# Altium project Relay_Module.PrjPcb
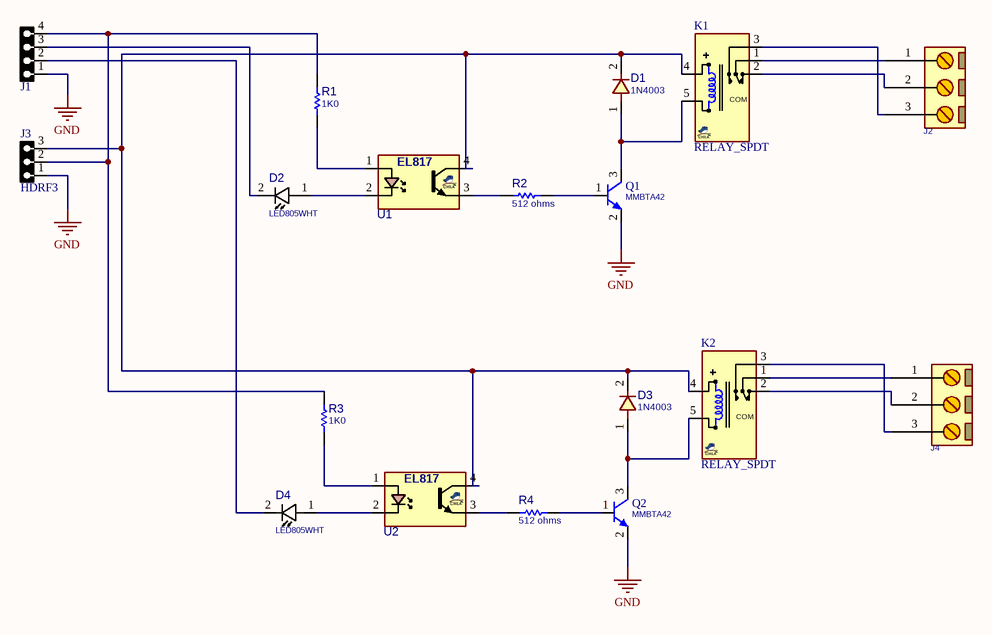
[diagram p0: Sheet1.SchDoc]
1 sheet, 18 parts. Net scope: global (net labels, ports and power ports of the same name join across sheets).
Board files: PCB1.PcbDoc, PCB1_Panel.PcbDoc

## Sheet Sheet1.SchDoc
size A4; SheetNumber: 1; SheetTotal: 1

### Parts
D1  1N4003  [D_SMA]
D2  LED805WHT  [LED0805WHT]
D3  1N4003  [D_SMA]
D4  LED805WHT  [LED0805WHT]
J1  HDRF4  [HDRRS_F_1X4]  (value not drawn)
J2  CONN_TB3  [TBB_3]  (value not drawn)
J3  HDRF3  [HDRRS_F_1X3]
J4  CONN_TB3  [TBB_3]  (value not drawn)
K1  RELAY_SPDT  [REL_SPDT_5_1611]
K2  RELAY_SPDT  [REL_SPDT_5_1611]
Q1  MMBTA42  [SOT23_3]
Q2  MMBTA42  [SOT23_3]
R1  1K0  [R0805]
R2  512 ohms  [R0805]
R3  1K0  [R0805]
R4  512 ohms  [R0805]
U1  EL817  [DIP_4SMD]  (value not drawn)
U2  EL817  [DIP_4SMD]  (value not drawn)

### Nets
GND: J1.1 J3.1 Q1.2(E) Q2.2(E)
NetD1_1: D1.1 K1.5(T2) Q1.3(C)
NetD1_2: D1.2 D3.2 J3.3 K1.4(T1) K2.4(T1) U1.4(C) U2.4(C)
NetD2_1: D2.1(ANODE) U1.2(K)
NetD2_2: D2.2(CATHODE) J1.3
NetD3_1: D3.1 K2.5(T2) Q2.3(C)
NetD4_1: D4.1(ANODE) U2.2(K)
NetD4_2: D4.2(CATHODE) J1.2
NetJ1_4: J1.4 J3.2 R1.2 R3.2
NetJ2_1: J2.1 K1.1(COM)
NetJ2_2: J2.2 K1.2(NC)
NetJ2_3: J2.3 K1.3(NO)
NetJ4_1: J4.1 K2.1(COM)
NetJ4_2: J4.2 K2.2(NC)
NetJ4_3: J4.3 K2.3(NO)
NetQ1_1: Q1.1(B) R2.2
NetQ2_1: Q2.1(B) R4.2
NetR1_1: R1.1 U1.1(A)
NetR2_1: R2.1 U1.3(E)
NetR3_1: R3.1 U2.1(A)
NetR4_1: R4.1 U2.3(E)

### Library data of the parts
D1 D3 = DIODE_SMD_1N4003: DIODE, GENERAL PURPOSE, 200V/1A; DESC: DESCRIPTION; PARAM: 200V VRRM; PARAM2: 1A; MANF: MANF; ASSEMBLY: ASSEMBLY; PRICE: PRICE; MANF_P#: 1N4003; VALUE: 1N4003
D2 D4 = LED_SMD_0805_WHT: LED, SMD, 0805, WHITE; DESC: DESCRIPTION; MANF_P#: MANF_PART#; PARAM2: 2.2V; MANF: MANF; ASSEMBLY: ASSEMBLY; PRICE: 36t@Javan; VALUE: LED805WHT
J1 = HDRRS_F_1X4: CONN, HEADER, Female, pitch: 2.54mm, 4POS; VALUE: HDRF4
J2 J4 = CONN_TB3: CONN, TERMINAL BLOCK, 5.08mm pitch; VALUE: CONN_TB3
J3 = HDRRS_F_1X3: CONN, HEADER, Female, pitch: 2.54mm, 3POS; VALUE: HDRF3
K1 K2 = RELAY_SPDT_5_1611_TRBS: Relay, SPDT, 5P, 15.5X11mm, TRB 125VAC/1A; MANF: TTI; MANF_P#: TRBS-6VDC-SA-CL; PARAM2: 1A, 125VAC/30VDC; PARAM: 12V, 17mA, 720Ohm; PRICE: -; Value: RELAY_SPDT
Q1 Q2 = NPN_MMBTA42_SOT23: BJT, NPN, 300v, 0.5A, SMD, SOT23; PARAM2: 625mW; MANF: ON/FAIRCHILD; PARAM: 300v, 0.5A; MANF_P#: MMBTA42; VALUE: MMBTA42
R1-R4 = RES_SMD_0805: RESISTOR, SMD; PARAM: -W; DESC: DESCRIPTION; DIST#: MOUSER; PARAM2: 1%; MANF_P#: -; MANF: -; ASSEMBLY: ASSEMBLY; PRICE: 100= 0.5$
  R1 R3: VALUE: 1K0
  R2 R4: VALUE: 512 ohms
U1 U2 = OPTC_TR4P_EL817_SMD: OPTOCOUPLER, TRANSISTOR, 4PIN; PARAM: IF=5mA; PARAM2: VCE = 5V; PRICE: 300t@Paya; VALUE: EL817; PACKAGE: DIP-4SMD